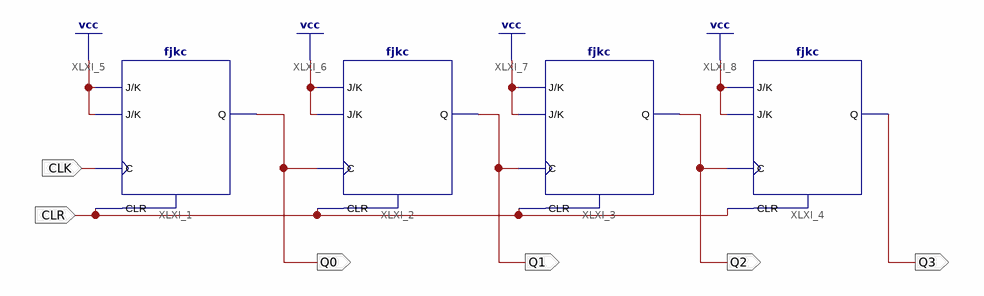
[diagram p0: schematic sheet 1]
// Xilinx ISE schematic ripple_counter.sch (spartan3a) as structural Verilog: 4 symbols, 6 ports
module ripple_counter (
  input  CLR,
  input  CLK,
  output Q0,
  output Q1,
  output Q2,
  output Q3
);

  fjkc XLXI_1 (.C(CLK), .CLR(CLR), .J(1'b1), .K(1'b1), .Q(Q0));
  fjkc XLXI_3 (.C(Q1), .CLR(CLR), .J(1'b1), .K(1'b1), .Q(Q2));
  fjkc XLXI_4 (.C(Q2), .CLR(CLR), .J(1'b1), .K(1'b1), .Q(Q3));
  fjkc XLXI_2 (.C(Q0), .CLR(CLR), .J(1'b1), .K(1'b1), .Q(Q1));
endmodule
